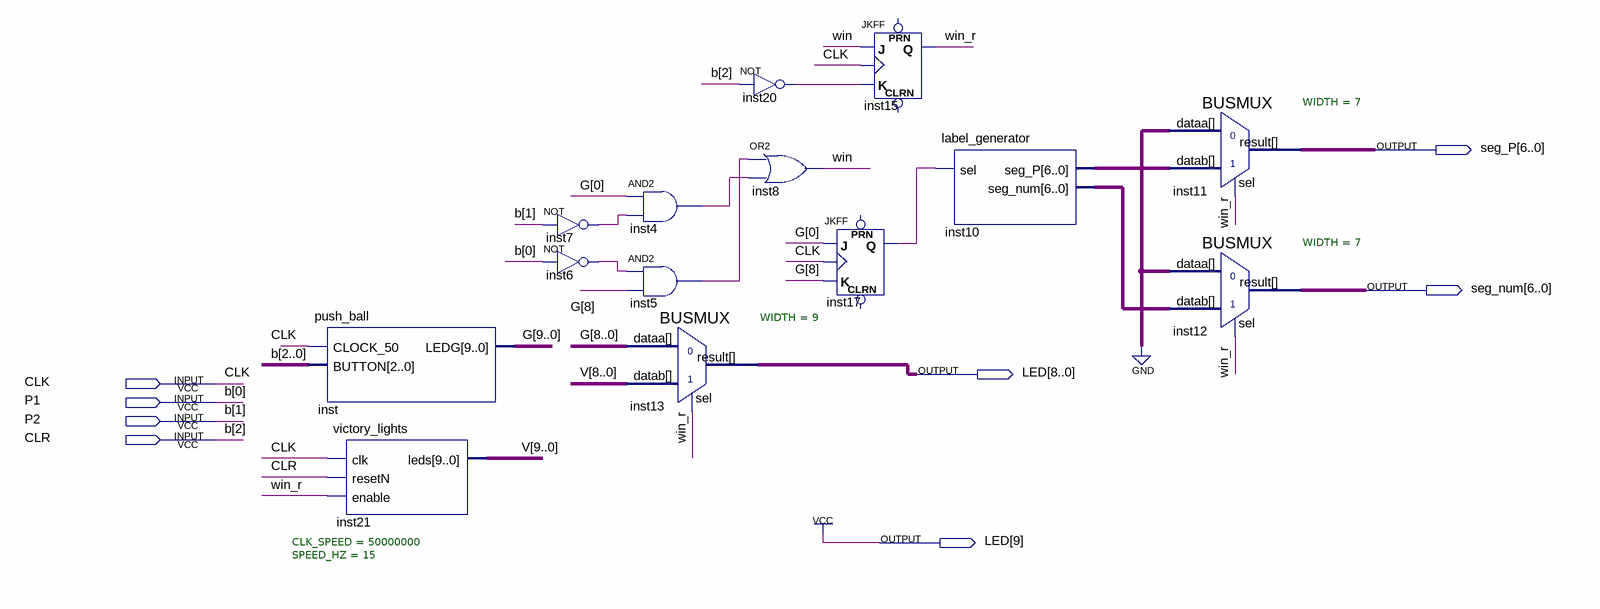
[diagram p0: schematic sheet]
// Quartus schematic push_ball_test.bdf as structural Verilog: 14 symbols, 8 pins
module push_ball_test (
  input  CLK,
  input  P1,
  input  P2,
  input  CLR,
  output [6:0] seg_P,
  output [6:0] seg_num,
  output [9:0] LED
);

  wire inst4_out, inst5_out, inst6_out, inst7_out, inst17_q, inst20_out, win, win_r;
  wire [6:0] inst10_seg_num, inst10_seg_p;
  wire [9:0] G, V;

  push_ball inst (.CLOCK_50(CLK), .BUTTON({CLR, P2, P1}), .LEDG(G));
  victory_lights #(.CLK_SPEED(50000000), .SPEED_HZ(15)) inst21 (.clk(CLK), .resetN(CLR), .enable(win_r), .leds(V));
  not inst7 (inst7_out, P2);
  not inst6 (inst6_out, P1);
  and inst4 (inst4_out, G[0], inst7_out);
  and inst5 (inst5_out, inst6_out, G[8]);
  BUSMUX #(.WIDTH(9)) inst13 (.datab(V[8:0]), .sel(win_r), .dataa(G[8:0]), .result(LED[8:0]));
  not inst20 (inst20_out, CLR);
  or inst8 (win, inst5_out, inst4_out);
  JKFF inst17 (.K(G[8]), .J(G[0]), .CLK(CLK), .Q(inst17_q));  // open: PRN, CLRN
  JKFF inst15 (.K(inst20_out), .J(win), .CLK(CLK), .Q(win_r));  // open: PRN, CLRN
  label_generator inst10 (.sel(inst17_q), .seg_P(inst10_seg_p), .seg_num(inst10_seg_num));
  BUSMUX #(.WIDTH(7)) inst11 (.datab(inst10_seg_p), .sel(win_r), .dataa({7{1'b0}}), .result(seg_P));
  BUSMUX #(.WIDTH(7)) inst12 (.datab(inst10_seg_num), .sel(win_r), .dataa({7{1'b0}}), .result(seg_num));

  assign LED[9] = 1'b1;

  // Other names for the same wires on the sheet: b[2:0] = {CLR, P2, P1}
endmodule
